# EAGLE design daughterboard (EAGLE 6.3)
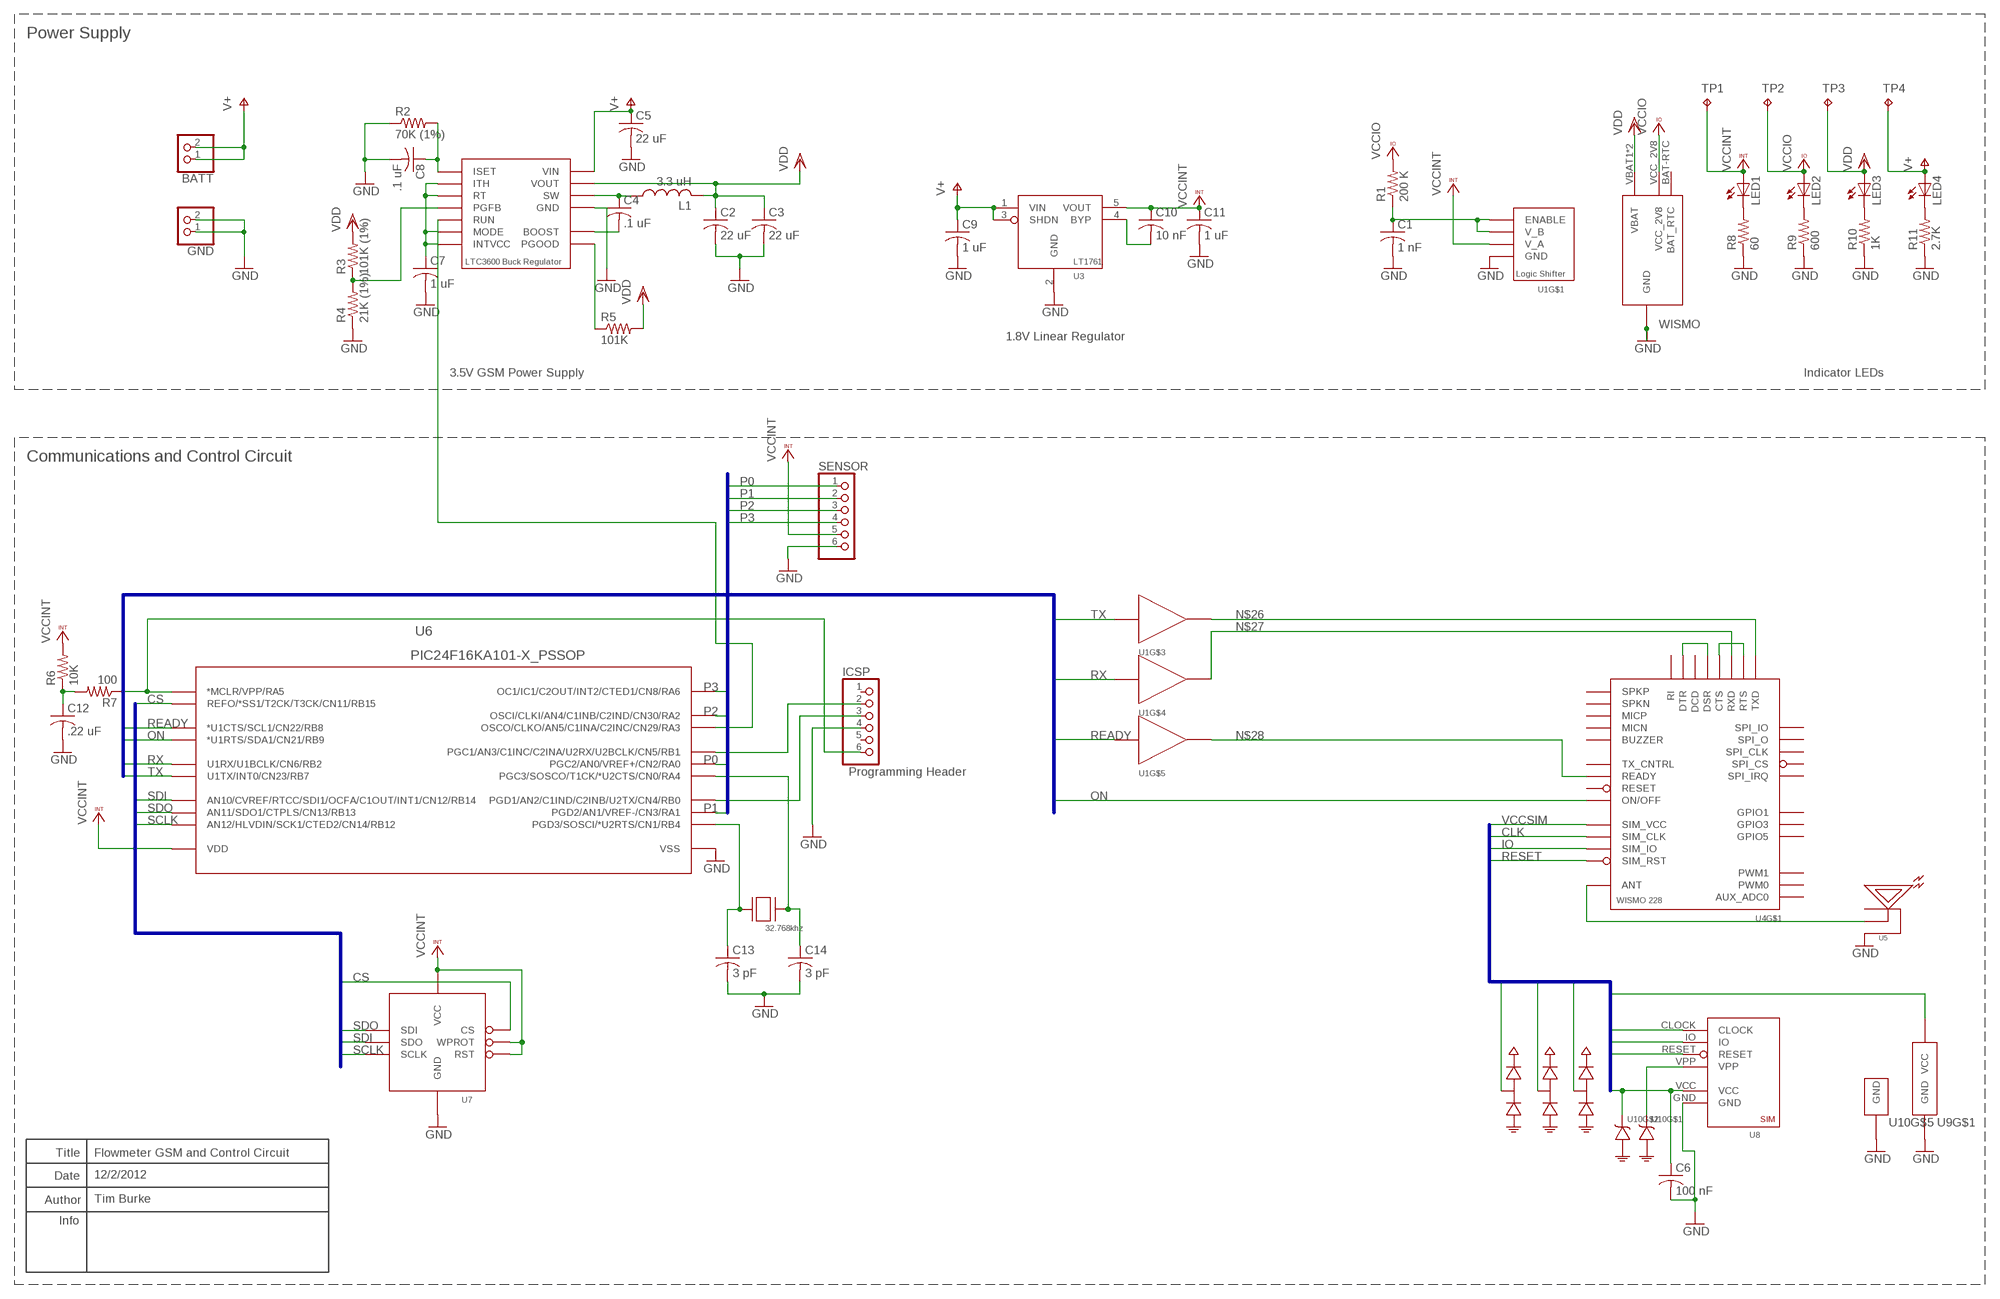
[diagram p0: schematic, sheet 1]

## Parts
BATT  PINHD-1X2  [1X02]
C1  1 nF  C-USC0402K  [C0402K]
C2  22 uF  C-USC1206  [C1206]
C3  22 uF  C-USC1206  [C1206]
C4  .1 uF  C-USC0402  [C0402]
C5  22 uF  C-USC1206K  [C1206K]
C6  100 nF  C-USC0402K  [C0402K]
C7  1 uF  C-USC0402K  [C0402K]
C8  .1 uF  C-USC0402K  [C0402K]
C9  1 uF  C-USC0402K  [C0402K]
C10  10 nF  C-USC0402K  [C0402K]
C11  1 uF  C-USC0402K  [C0402K]
C12  .22 uF  C-USC0402K  [C0402K]
C13  3 pF  C-USC0402K  [C0402K]
C14  3 pF  C-USC0402K  [C0402K]
GND  PINHD-1X2  [1X02]
ICSP  PINHD-1X6  [1X06]
L1  3.3 uH  L-US  [INDUCTORPROTO]
LED1  LEDSML0603  [SML0603]
LED2  LEDSML0603  [SML0603]
LED3  LEDSML0603  [SML0603]
LED4  LEDSML0603  [SML0603]
R1  200 K  R-US_R0603  [R0603]
R2  70K (1%)  R-US_R0603  [R0603]
R3  101K (1%)  R-US_R0603  [R0603]
R4  21K (1%)  R-US_R0603  [R0603]
R5  101K  R-US_R0603  [R0603]
R6  10K  R-US_R0603  [R0603]
R7  100  R-US_R0603  [R0603]
R8  60  R-US_R0603  [R0603]
R9  600  R-US_R0603  [R0603]
R10  1K  R-US_R0603  [R0603]
R11  2.7K  R-US_R0603  [R0603]
SENSOR  PINHD-1X6  [1X06]
TP1  TPB2,54  [B2,54]
TP2  TPB2,54  [B2,54]
TP3  TPB2,54  [B2,54]
TP4  TPB2,54  [B2,54]
U1  LEVELSHIFTER  [TSSOP16]
U2  LTC3600  [MSOP12]
U3  LT1761  [SOT23-5L]
U4  WISMO_228  [GSM_MODULE]
U5  RFANTENNA  [RFJACK]
U6  PIC24F16KA101-X_PSSOP  [SSOP20]
U7  FLASH8MSOP8  [SOP08]
U8  SIMSLOT  [SIMSLOT]
U9  DALC208  [SOT23-6L]
U10  ESDA6V1SC6  [SOT23-6L]
XTAL1  32.768khz  SMD-XTAL  [SMDXTAL]

## Nets
CLK: U4.SIM_CLK U8.CLOCK U9.1
CS: U6.18(REFO/*SS1/T2CK/T3CK/CN11/RB15) U7.1(CS)
GND: C1.2 C2.2 C3.2 C5.2 C6.2 C7.2 C8.2 C9.2 C11.2 C12.2 C13.2 C14.2 GND.1 GND.2 ICSP.4 R2.1 R4.1 R8.1 R9.1 R10.1 R11.1 SENSOR.6 U1.1(GND) U2.EXPOSED(GND) U3.2(GND) U4.GND U4.GND1(GND) U4.GND2(GND) U4.GND3(GND) U4.GND4(GND) U4.GND5(GND) U5.UNUSED1(SHIELD) U5.UNUSED2(SHIELD) U6.19(VSS) U7.4(GND) U8.GND U9.5(GND) U10.2 U10.5
IO: U4.SIM_IO U8.IO U9.4
N$1: U4.ANT U5.ANTENNA(PIN)
N$2: C7.1 U2.PAD2(ITH) U2.PAD3(RT) U2.PAD6(MODE) U2.PAD10(INTVCC)
N$3: U4.CT107/DSR(DSR) U4.CT108/DTR(DTR)
N$4: C1.1 R1.1 U1.15(V_B) U1.16(ENABLE)
N$5: U8.VPP U10.1
N$6: R3.1 R4.2 U2.PAD4(PGFB)
N$7: LED1.C R8.2
N$8: LED2.C R9.2
N$9: C4.2 U2.PAD9(BOOST)
N$10: C8.1 R2.2 U2.PAD1(ISET)
N$11: LED3.C R10.2
N$12: LED4.C R11.2
N$14: U2.PAD5(RUN) U6.8(OSCO/CLKO/AN5/C1INA/C2INC/CN29/RA3)
N$17: R5.1 U2.PAD12(PGOOD)
N$18: ICSP.2 U6.5(PGC1/AN3/C1INC/C2INA/U2RX/U2BCLK/CN5/RB1)
N$19: ICSP.3 U6.4(PGD1/AN2/C1IND/C2INB/U2TX/CN4/RB0)
N$20: C10.2 U3.4(BYP)
N$21: C12.1 R6.1 R7.2
N$22: ICSP.6 R7.1 U6.1(*MCLR/VPP/RA5)
N$23: U4.CT105/RTS(RTS) U4.CT106/CTS(CTS)
N$24: C14.1 U6.10(PGC3/SOSCO/T1CK/*U2CTS/CN0/RA4) XTAL1.4(XTAL2)
N$25: C13.1 U6.9(PGD3/SOSCI/*U2RTS/CN1/RB4) XTAL1.1(XTAL1)
N$26: U1.13(B) U4.CT103/TXD(TXD)
N$27: U1.12(B) U4.CT104/RXD(RXD)
N$28: U1.11(B) U4.WISMO_READY(READY)
ON: U4.ON/OFF U6.13(*U1RTS/SDA1/CN21/RB9)
P0: SENSOR.1 U6.2(PGC2/AN0/VREF+/CN2/RA0)
P1: SENSOR.2 U6.3(PGD2/AN1/VREF-/CN3/RA1)
P2: SENSOR.3 U6.7(OSCI/CLKI/AN4/C1INB/C2IND/CN30/RA2)
P3: SENSOR.4 U6.14(OC1/IC1/C2OUT/INT2/CTED1/CN8/RA6)
READY: U1.6(A) U6.12(*U1CTS/SCL1/CN22/RB8)
RESET: U4.SIM_RST U8.RESET U9.3
RX: U1.5(A) U6.6(U1RX/U1BCLK/CN6/RB2)
SCLK: U6.15(AN12/HLVDIN/SCK1/CTED2/CN14/RB12) U7.6(SCLK)
SDI: U6.17(AN10/CVREF/RTCC/SDI1/OCFA/C1OUT/INT1/CN12/RB14) U7.2(SDO)
SDO: U6.16(AN11/SDO1/CTPLS/CN13/RB13) U7.5(SDI)
SW: C4.1 L1.P1 U2.PAD7(SW)
TX: U1.4(A) U6.11(U1TX/INT0/CN23/RB7)
V+: BATT.1 BATT.2 C5.1 C9.1 LED4.A TP4.TP U2.PAD8(VIN) U3.1(VIN) U3.3(SHDN)
VCCINT: C10.1 C11.1 LED1.A R6.2 SENSOR.5 TP1.TP U1.2(V_A) U3.5(VOUT) U6.20(VDD) U7.3(WPROT) U7.7(RST) U7.8(VCC)
VCCIO: LED2.A R1.2 TP2.TP U4.VCC_2V8
VCCSIM: C6.1 U4.SIM_VCC U8.VCC U9.2(VCC) U10.3
VDD: C2.1 C3.1 L1.P2 LED3.A R3.2 R5.2 TP3.TP U2.PAD11(VOUT) U4.VBAT1(VBAT) U4.VBAT2(VBAT)
Unconnected: ICSP.1 ICSP.5 U1.3(A) U1.7(A) U1.8(A) U1.9(B) U1.10(B) U1.14(B) U4.AUX_ADC0 U4.BAT-RTC(BAT_RTC) U4.BUZZER U4.CT109/DCD(DCD) U4.CT125/RI(RI) U4.GPIO1 U4.GPIO3 U4.GPIO5 U4.MICN U4.MICP U4.PWM0 U4.PWM1 U4.RESET U4.SPI-CLK(SPI_CLK) U4.SPI-CS(SPI_CS) U4.SPI-IO(SPI_IO) U4.SPI-IRQ(SPI_IRQ) U4.SPI-O(SPI_O) U4.SPKN U4.SPKP U4.TX_CTRL(TX_CNTRL) U9.6 U10.4 U10.6

## Buses
VCCSIM,CLK,IO,RESET
SPI:CS,SDI,SDO,SCLK
COMMS:TX,RX,READY,ON
EXTERNAL:P[0..5]

## Notes on the sheet
- Power Supply
- WISMO
- 1.8V Linear Regulator
- 3.5V GSM Power Supply | Indicator LEDs
- Communications and Control Circuit
- Programming Header
- Title | Flowmeter GSM and Control Circuit
- Date | 12/2/2012
- Author | Tim Burke
- Info

## Library data of the parts
BATT GND = pinhead:PINHD-1X2: PIN HEADER
C1-C14 = rcl:C-US: CAPACITOR, American symbol
ICSP SENSOR = pinhead:PINHD-1X6: PIN HEADER
L1 = components:L-US: INDUCTOR, American symbol
LED1-LED4 = led:LED: LED OSRAM: - CHIPLED LG R971, LG N971, LY N971, LG Q971, LY Q971, LO R971, LY R971 LH N974, LH R974 LS Q976, LO Q976, LY Q976 LO Q996 - Hyper CHIPLED LW Q18S LB Q993, LB Q99A, LB R99A - SideLED LS A670, LO A670, LY A670, LG A670, LP A670 LB A673, LV A673, LT A673, LW A673 LH A674 LY A675 LS A676, LA A676, LO A676, LY A676, LW A676 LS A679, LY A679, LG A679 - Hyper Micro SIDELED® LS Y876, LA Y876, LO Y876, LY Y876 LT Y87S - SmartLED LW L88C, LW L88S LB L89C, LB L89S, LG L890 LS L89K, LO L89K, LY L89K LS L896, LA L896, LO L896, LY L896 - TOPLED LS T670, LO T670, LY T670, LG T670, LP T670 LSG T670, LSP T670, LSY T670, LOP T670, LYG T670 LG T671, LOG T671, LSG T671 LB T673, LV T673, LT T673, LW T673 LH T674 LS T676, LA T676, LO T676, LY T676, LB T676, LH T676, LSB T676, LW T676 LB T67C, LV T67C, LT T67C, LS T67K, LO T67K, LY T67K, LW E67C LS E67B, LA E67B, LO E67B, LY E67B, LB E67C, LV E67C, LT E67C LW T67C LS T679, LY T679, LG T679 LS T770, LO T770, LY T770, LG T770, LP T770 LB T773, LV T773, LT T773, LW T773 LH T774 LS E675, LA E675, LY E675, LS T675 LS T776, LA T776, LO T776, LY T776, LB T776 LHGB T686 LT T68C, LB T68C - Hyper Mini TOPLED® LB M676 - Mini TOPLED Santana® LG M470 LS M47K, LO M47K, LY M47K Source: http://www.osram.convergy.de LUXEON: - LUMILED® LXK2-PW12-R00, LXK2-PW12-S00, LXK2-PW14-U00, LXK2-PW14-V00 LXK2-PM12-R00, LXK2-PM12-S00, LXK2-PM14-U00 LXK2-PE12-Q00, LXK2-PE12-R00, LXK2-PE12-S00, LXK2-PE14-T00, LXK2-PE14-U00 LXK2-PB12-K00, LXK2-PB12-L00, LXK2-PB12-M00, LXK2-PB14-N00, LXK2-PB14-P00, LXK2-PB14-Q00 LXK2-PR12-L00, LXK2-PR12-M00, LXK2-PR14-Q00, LXK2-PR14-R00 LXK2-PD12-Q00, LXK2-PD12-R00, LXK2-PD12-S00 LXK2-PH12-R00, LXK2-PH12-S00 LXK2-PL12-P00, LXK2-PL12-Q00, LXK2-PL12-R00 Source: www.luxeon.com KINGBRIGHT: KA-3528ASYC Source: www.kingbright.com
R1-R11 = rcl:R-US_: RESISTOR, American symbol
TP1-TP4 = testpad:TP: Test pad
U1 = components:LEVELSHIFTER
U2 = components:LTC3600: LTC3600 Buck Regulator
U3 = components:LT1761: LT1761 - 1.8V Low Quiescent Current Linear Regulator
U4 = components:WISMO_228: WISMO 228 GSM Integrated Module from AirPrime
U5 = components:RFANTENNA
U6 = components:PIC24F16KA101-X_P
U7 = components:FLASH8M
U8 = components:SIMSLOT: Molex SIM Card Slot
U9 = components:DALC208: Low Capacitance Diode Array (4 Pack)
U10 = components:ESDA6V1SC6: ESD Diode Array (4-pack)
XTAL1 = components:SMD-XTAL

## Net classes
0 default: width 0.203 mm, drill 0.381 mm, clearance 0.203 mm

## Board
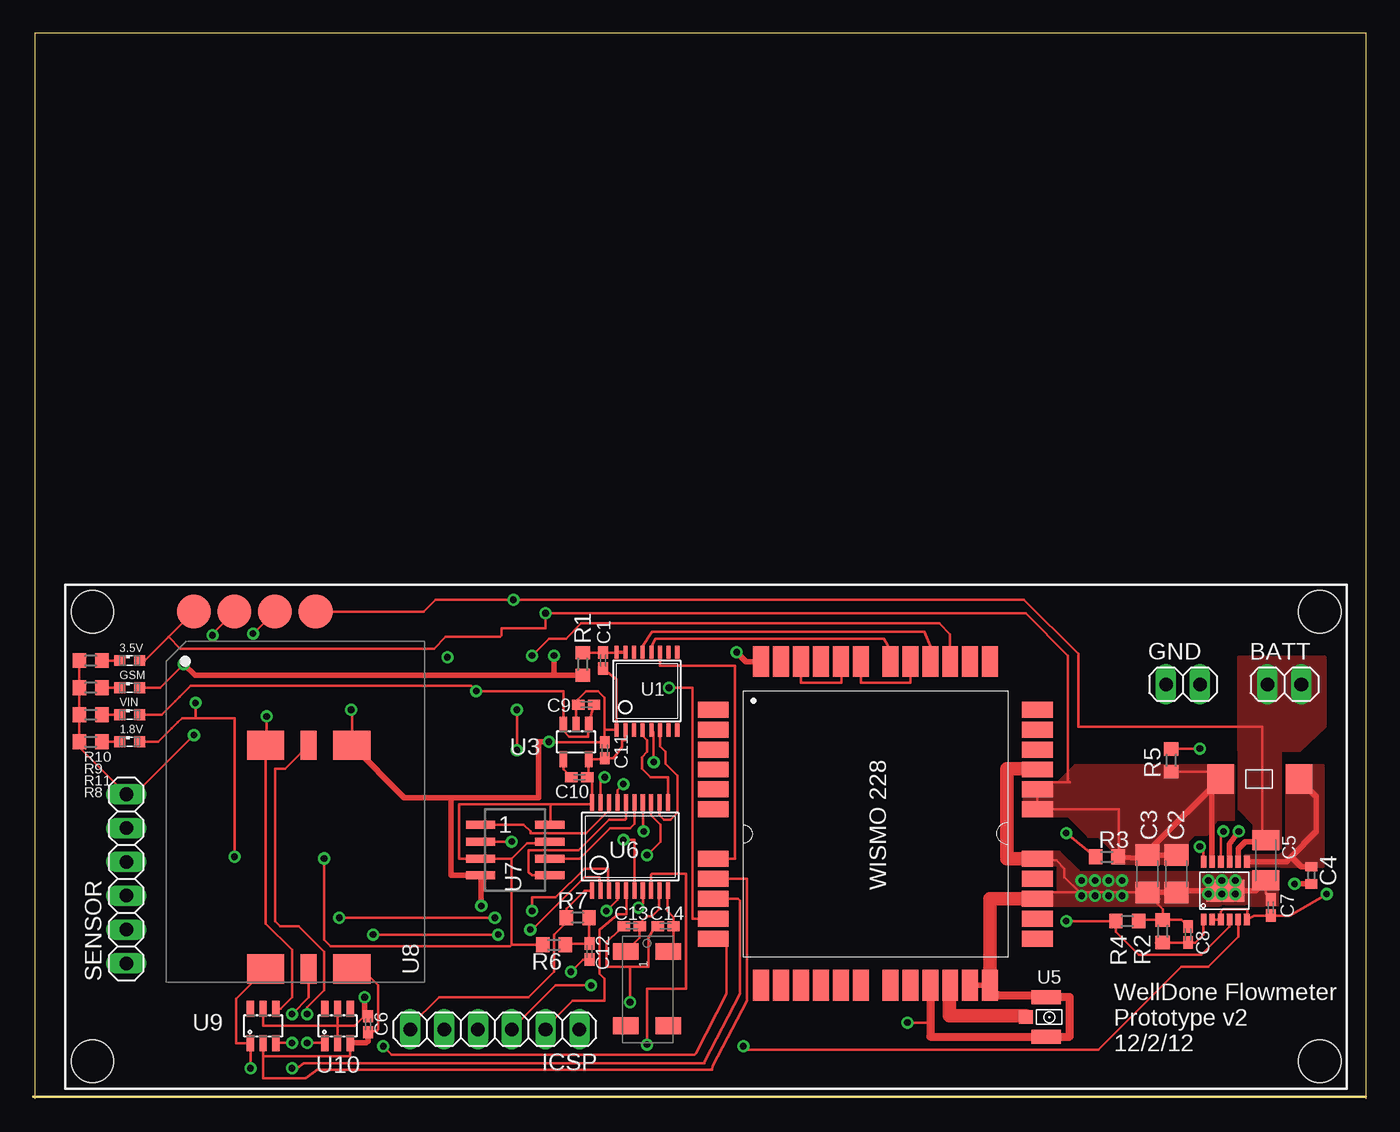
[diagram p1: board, top side]
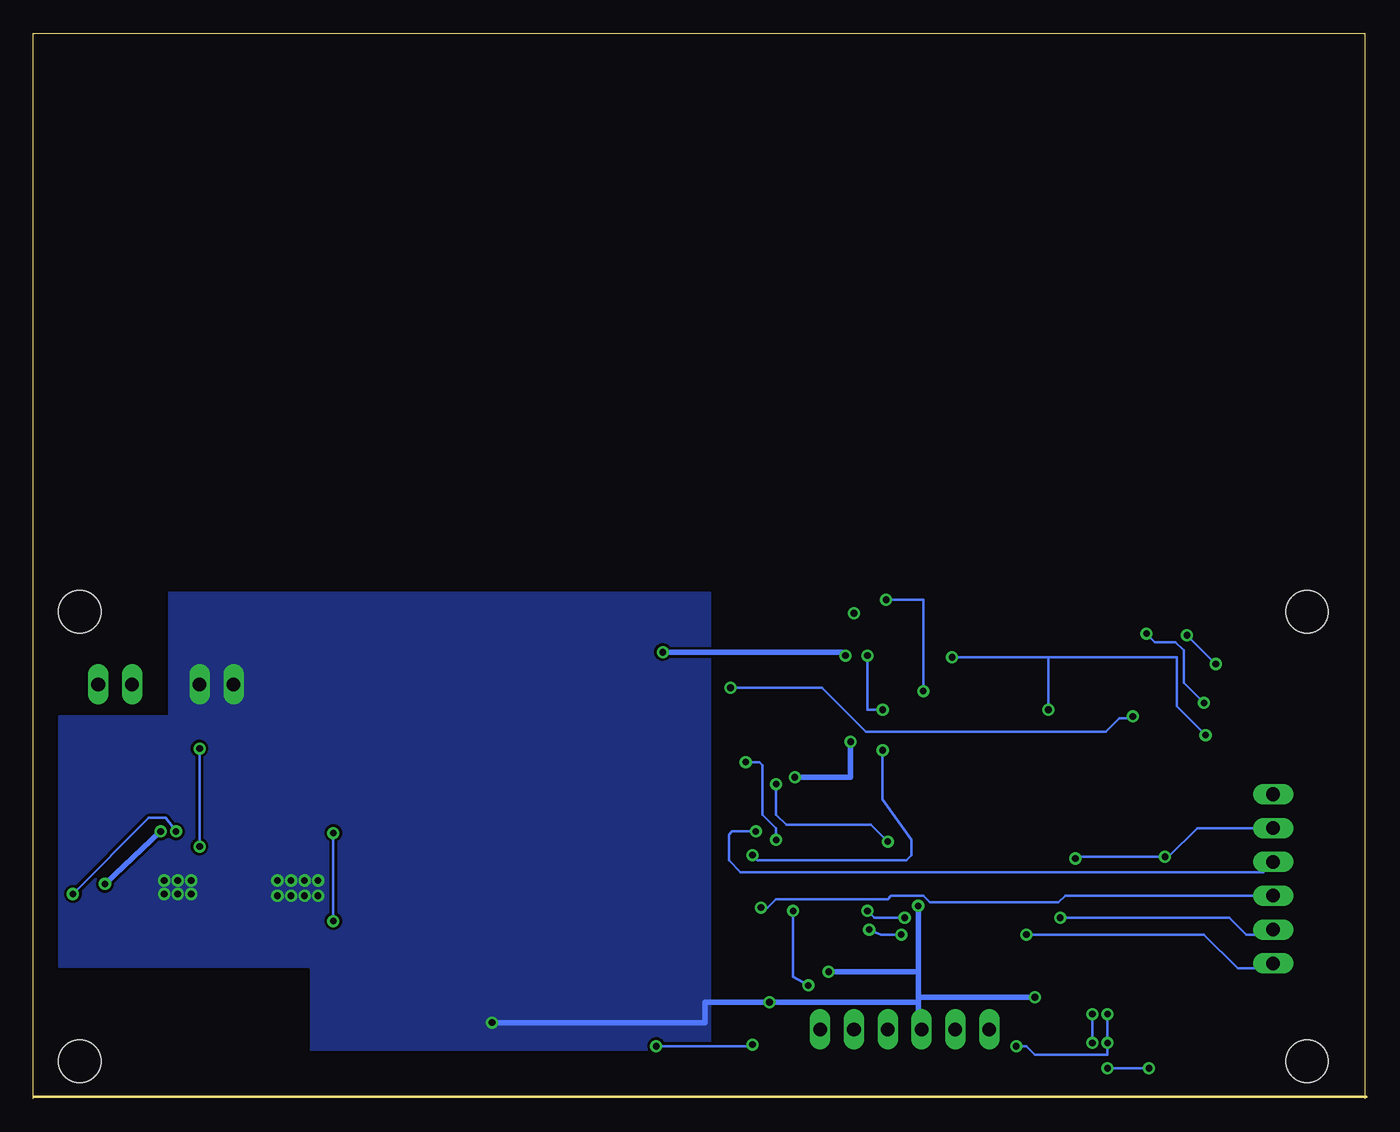
[diagram p2: board, bottom side, seen from below]

Size 100.13 x 80 mm. Coordinates in mm from the lower left corner, seen from the top.
Outline: 100.13,0 100.13,80 0.13,80 0.13,0
Outline: 100.08,0.13 0,0.13
Copper layers (1*16): Top 0.035mm / dielectric 1.5mm / Bottom 0.035mm
Design rules "default *": minimum track width 8mil, minimum drill 15mil, track to track 6mil, track to pad 6mil, pad to pad 6mil, via to via 6mil, smd to smd 6mil, copper to edge 40mil, drill to drill 8mil, minimum pad ring 10mil, minimum via ring 8mil, stop-mask expansion 4mil, vias tented up to drill 0mil, thermal gap 10mil
Holes 3.2 mm at 4.44,36.58 4.44,2.79 96.65,36.58 96.65,2.79

### Footprints (pad centres in the part's own frame; a part is rotated, then mirrored left to right if it is on the bottom)
1X02 = drill 1.016 long: 1 -1.27,0; 2 1.27,0
C0402K = smd 0.925 x 0.74: 1 -0.6,0; 2 0.6,0
C1206 = smd 1.6 x 1.8: 1 -1.4,0; 2 1.4,0
C0402 = smd 0.7 x 0.9: 1 -0.65,0; 2 0.65,0
C1206K = smd 1.5 x 2: 1 -1.5,0; 2 1.5,0
1X06 = drill 1.016 long: 1 -6.35,0; 2 -3.81,0; 3 -1.27,0; 4 1.27,0; 5 3.81,0; 6 6.35,0
INDUCTORPROTO = smd 2 x 2.2: P1 -3,0; P2 2.9,0
SML0603 = smd 0.8 x 0.8: A 0.75,0; C -0.75,0
R0603 = smd 1 x 1.1: 1 -0.85,0; 2 0.85,0
B2,54 = smd 2.54 x 2.54: TP 0,0
TSSOP16 = smd 0.305 x 0.991: 1 -2.275,-2.918; 2 -1.625,-2.918; 3 -0.975,-2.918; 4 -0.325,-2.918; 5 0.325,-2.918; 6 0.975,-2.918; 7 1.625,-2.918; 8 2.275,-2.918; 9 2.275,2.918; 10 1.625,2.918; 11 0.975,2.918; 12 0.325,2.918; 13 -0.325,2.918; 14 -0.975,2.918; 15 -1.625,2.918; 16 -2.275,2.918
MSOP12 = smd 2.845 x 1.651: EXPOSED 0,0 | smd 0.419 x 0.889: PAD1 -1.632,-2.172; PAD2 -0.982,-2.172; PAD3 -0.331,-2.172; PAD4 0.319,-2.172; PAD5 0.969,-2.172; PAD6 1.619,-2.172; PAD7 1.619,2.172; PAD8 0.969,2.172; PAD9 0.319,2.172; PAD10 -0.331,2.172; PAD11 -0.982,2.172; PAD12 -1.632,2.172
SOT23-5L = smd 0.55 x 1.2: 1 -0.95,-1.3; 2 0,-1.3; 3 0.95,-1.3; 4 0.95,1.3; 5 -0.95,1.3
GSM_MODULE = smd 2.3 x 1.2: ANT 21.2,-7.2; CT103/TXD -3.1,-8.7; CT104/RXD -3.1,-11.7; CT105/RTS -3.1,-10.2; CT106/CTS -3.1,-13.9; CT107/DSR -3.1,-15.4; CT108/DTR -3.1,-18.4; CT109/DCD -3.1,-16.9; CT125/RI -3.1,-19.9; GND1 21.2,-8.7; GND2 21.2,-5.7; GND3 21.2,-4.2; GPIO3 21.2,-15.4; GPIO5 21.2,-10.2; ON/OFF -3.1,-7.2; PWM0 -3.1,-5.7; PWM1 -3.1,-4.2; RESET 21.2,-21.4; SPI-CLK 21.2,-16.9; SPI-CS 21.2,-13.9; SPI-IO 21.2,-19.9; SPI-O 21.2,-18.4; TX_CTRL 21.2,-11.7; VCC_2V8 -3.1,-21.4 | smd 1.2 x 2.3: AUX_ADC0 6.5,-25; BAT-RTC 8,-25; BUZZER 0.5,-0.65; GND 11.7,-0.65; GND4 14.7,-0.65; GND5 5,-0.65; GPIO1 17.7,-0.65; MICN 5,-25; MICP 3.5,-25; NC 13.2,-0.65; NC2 3.5,-0.65; NC3 2,-0.65; SIM_CLK 14.7,-25; SIM_IO 16.2,-25; SIM_RST 17.7,-25; SIM_VCC 13.2,-25; SPI-IRQ 16.2,-0.65; SPKN 2,-25; SPKP 0.5,-25; VBAT1 8,-0.65; VBAT2 6.5,-0.65; WISMO_READY 11.7,-25
RFJACK = smd 1.05 x 1: ANTENNA 2.795,1.488 | smd 2.2 x 1.05: UNUSED1 1.27,2.953; UNUSED2 1.27,0
SSOP20 = smd 0.305 x 1.245: 1 -2.857,-3.302; 2 -2.222,-3.302; 3 -1.587,-3.302; 4 -0.952,-3.302; 5 -0.317,-3.302; 6 0.318,-3.302; 7 0.953,-3.302; 8 1.588,-3.302; 9 2.223,-3.302; 10 2.858,-3.302; 11 2.858,3.302; 12 2.223,3.302; 13 1.588,3.302; 14 0.953,3.302; 15 0.318,3.302; 16 -0.317,3.302; 17 -0.952,3.302; 18 -1.587,3.302; 19 -2.222,3.302; 20 -2.857,3.302
SOP08 = smd 0.6 x 2.2: 1 -1.905,-2.6; 2 -0.635,-2.6; 3 0.635,-2.6; 4 1.905,-2.6; 5 1.905,2.6; 6 0.635,2.6; 7 -0.635,2.6; 8 -1.905,2.6
SIMSLOT = smd 2.2 x 2.8: CLOCK 1.1,3.24; GND 17.9,-3.24; IO 17.9,3.24; VCC 1.1,-3.24 | smd 2.2 x 1.2: RESET 1.1,0; VPP 17.9,0
SOT23-6L = smd 0.55 x 1.2: 1 -0.95,-1.3; 2 0,-1.3; 3 0.95,-1.3; 4 0.95,1.3; 5 0,1.3; 6 -0.95,1.3
SMDXTAL = smd 1.27 x 1.905: 1 -2.794,-1.587; 2 2.794,-1.587; 3 2.794,1.587; 4 -2.794,1.587

### Placement (x,y rotation side)
BATT  93.98,31.11 0 top
C1  42.8,32.89 270 top
C2  85.85,16.89 270 top
C3  83.69,16.89 270 top
C4  96.01,16.76 270 top
C5  92.58,17.91 270 top
C6  25.15,5.59 90 top
C7  92.96,14.35 90 top
C8  86.74,12.32 90 top
C9  41.53,29.59 180 top
C10  41.02,24.13 180 top
C11  42.93,26.16 90 top
C12  41.78,11.05 270 top
C13  44.96,12.95 180 top
C14  47.5,12.95 180 top
GND  86.36,31.11 0 top
ICSP  34.67,5.21 180 top
L1  92.07,24 180 top
LED1  7.24,26.8 0 top
LED2  7.24,30.86 0 top
LED3  7.24,32.89 0 top
LED4  7.24,28.83 0 top
R1  41.28,32.64 270 top
R2  84.84,12.57 270 top
R3  80.64,18.16 0 top
R4  82.17,13.34 180 top
R5  85.47,25.4 270 top
R6  39.12,11.56 180 top
R7  40.89,13.59 0 top
R8  4.32,26.8 0 top
R9  4.32,30.86 0 top
R10  4.32,32.89 0 top
R11  4.32,28.83 0 top
SENSOR  6.98,16.51 90 top
TP1  18.16,36.58 0 top
TP2  15.11,36.58 0 top
TP3  12.07,36.58 0 top
TP4  21.21,36.58 0 top
U1  46.1,30.61 0 top
U2  89.53,15.62 0 top
U3  40.77,26.8 180 top
U4  76.07,29.72 270 top
U5  77.34,7.62 180 top
U6  44.83,18.92 0 top
U7  36.2,18.67 270 top
U8  20.7,8.64 90 top
U9  17.27,5.46 0 top
U10  22.86,5.46 0 top
XTAL1  46.1,8.26 270 top

### Tracks (layer width: path | path; a pad name or v marks a point on that pad's centre or on a via)
CLK  (via drill 0.5)
  Top 0.203: U8.CLOCK 15.24,7.51 15.24,4.16 U9.1 v16.32,2.29 | U4.SIM_CLK 52.93,15.02 53.09,14.86 53.09,7.87 50.43,2.79 50.42,2.67 20.32,2.67 19.81,2.29 v19.43,2.29
  Bottom 0.203: v16.32,2.29 v19.43,2.29
CS
  Top 0.203: U7.1 36.83,20.57 37.34,20.07 37.34,19.94 41.53,19.94 43.24,21.65 U6.18 43.24,21.91
GND  (via drill 0.5)
  Top 0.203: R4.1 83.11,13.42 R2.1 | R2.1 86.24,13.42 C8.2 | 84.58,14.98 C3.2 | C7.2 92.58,15.46 C5.2 | R2.1 84.84,14.22 83.69,15.37 C3.2 | C1.2 43.82,31.5 43.82,27.7 U1.1 42.93,27.69 | U3.2 40.77,29.59 C9.2 40.93,30.01 41.53,30.61 42.42,30.61 42.93,30.1 42.93,27.69 | 42.93,27.69 C11.2 38.73,26.76 v38.73,26.8 | U4.GND4 75.9,15.49 C3.2 | U4.GND 75.53,17.91 76.83,17.91 77.47,17.27 77.47,16.64 78.62,15.49 C3.2 | C14.2 46.48,12.54 46.23,12.06 46.23,9.91 44.83,9.91 | C13.2 43.05,11.78 43.05,9.91 44.83,9.91 | U7.4 33.66,16.76 | C12.2 41.31,10.45 v40.39,9.53 | 44.83,9.91 v44.83,7.24 | 22.86,5.46 U10.2 | U10.5 22.86,5.46 | 22.86,5.46 24.13,5.46 24.86,6.19 C6.2 24.89,6.19 | U9.5 17.27,5.46 22.86,5.46 | U8.GND 23.94,29.14 v23.88,29.21 | v31.11,33.15 31.11,33.16 | U6.19 42.61,24.13 v42.93,24.13 | U4.GND1 67.44,8.52 67.44,5.71 v65.66,5.71 | R8.1 R11.1 R9.1 R10.1 | 3.43,26.76 R8.1 | v12.07,27.3 7.62,22.86 SENSOR.6 3.47,26.38 R8.1
  Top 0.406: U4.GND3 U4.GND2 | C3.2 C2.2 86.36,15.62 U2.EXPOSED 91.8,15.62 C5.2 | 33.66,16.76 v33.66,14.48 | 24.89,6.19 v24.89,7.62 | U7.4 31.37,16.76 31.37,22.61 | 31.37,22.61 37.97,22.61 37.97,26.8 v38.73,26.8 | 31.37,22.61 27.87,22.61 U8.GND
  Top 0.61: U4.GND1 67.37,4.67 U5.UNUSED1 77.85,4.67 77.85,7.62 U5.UNUSED2 76.07,7.75 72.64,7.75 arc-90 U4.GND3
  Top 1.016: U4.GND 73.15,18.02 73.15,24.77 75.42,24.77 U4.GND5 | U4.GND4 71.87,15.02 U4.GND3
  Bottom 0.203: 33.66,5.46 ICSP.4 | 33.78,9.53 33.66,9.4 | v23.88,29.21 23.88,33.15 | 23.88,33.15 v31.11,33.15 | 23.88,33.15 14.22,33.15 14.22,29.46 v12.07,27.3
  Bottom 0.406: v33.66,14.48 33.66,9.4 33.66,7.62 | 33.66,7.62 33.66,7.24 | 33.66,7.24 33.66,5.46 | v40.39,9.53 33.78,9.53 | 33.66,7.24 v44.83,7.24 49.66,7.24 49.66,5.71 v65.66,5.71 | v24.89,7.62 33.66,7.62 | v42.93,24.13 38.73,24.13 v38.73,26.8
  other vias: 78.74,16.38 79.76,16.38 80.77,16.38 81.79,16.38 81.79,15.24 80.77,15.24 79.76,15.24 78.74,15.24 88.27,16.38 89.28,16.38 90.3,16.38 90.3,15.37 89.28,15.37 88.27,15.37
  pour Top (no thermals): 74.3,14.48 93.47,14.48 93.47,17.02 78.49,17.02 78.49,17.14 77.09,18.54 74.3,18.54 74.3,17.53 76.96,17.53 76.96,15.49 74.3,15.49
  pour Bottom (no thermals): 49.28,3.68 49.28,37.97 89.92,37.97 89.92,28.7 98.17,28.7 98.17,9.91 79.25,9.91 79.25,3.68
IO  (via drill 0.5)
  Top 0.203: U9.4 18.57,6.76 19.43,7.62 19.43,11.18 17.46,13.15 U8.IO 17.53,26.6 v17.53,28.7 | U4.SIM_IO 49.53,13.52 49.53,30.86 v47.75,30.86
  Bottom 0.203: v17.53,28.7 17.65,28.57 18.54,28.57 19.56,27.56 37.59,27.56 40.89,30.86 v47.75,30.86
N$1
  Top 1.016: U4.ANT 68.83,8.52 68.83,6.22 74.55,6.22 U5.ANTENNA
N$2  (via drill 0.5)
  Top 0.203: U2.PAD2 U2.PAD3 89.2,14.02 89.41,14.22 91.19,14.22 91.19,13.48 | 91.19,13.48 U2.PAD6 | U2.PAD10 89.2,19.73 v89.41,20.07 | v97.16,15.37 94.4,13.75 C7.1 91.71,13.75 91.19,13.48
  Bottom 0.203: v89.41,20.07 90.17,21.08 91.44,21.08 v97.16,15.37
N$3
  Top 0.203: U4.CT108/DTR 57.67,31.24 60.71,31.24 60.71,32.82 U4.CT107/DSR
N$4
  Top 0.203: U1.16 43.79,33.49 C1.1 R1.1
  Top 0.254: U1.15 U1.16
N$5  (via drill 0.5)
  Top 0.203: U10.1 21.91,4.19 v20.57,4.19 | v20.57,6.35 20.57,6.86 21.84,8.13 21.84,11.05 19.94,12.95 18.54,12.95 18.16,13.34 18.16,24.77 18.93,24.77 U8.VPP
  Bottom 0.203: v20.57,4.19 v20.57,6.35
N$6  (via drill 0.5)
  Top 0.203: U2.PAD4 89.85,12.89 87.76,10.79 83.06,10.79 81.32,12.53 R4.2 v77.6,13.34 | R3.1 v77.6,19.94
  Bottom 0.203: v77.6,19.94 v77.6,13.34
N$7
  Top 0.203: R8.2 LED1.C
N$8
  Top 0.203: R9.2 LED2.C
N$9  (via drill 0.5)
  Top 0.406: U2.PAD9 89.85,19.11 v90.55,20.07 | v94.74,16.13 96,16.13 C4.2
  Bottom 0.406: v90.55,20.07 v94.74,16.13
N$10
  Top 0.203: R2.2 84.33,11.72 C8.1 87.28,11.72 87.88,12.32 87.88,13.43 U2.PAD1
N$11
  Top 0.203: R10.2 LED3.C
N$12
  Top 0.203: R11.2 LED4.C
N$14  (via drill 0.5)
  Top 0.203: v46.1,4.06 46.1,8.26 49.02,8.26 49.02,16.89 46.48,16.89 46.42,16.83 U6.8 | U2.PAD5 90.5,12.14 88.27,9.91 86.23,9.91 80.01,3.68 53.59,3.68 v53.34,3.94
  Bottom 0.203: v46.1,4.06 46.1,3.94 v53.34,3.94
N$17  (via drill 0.5)
  Top 0.203: U2.PAD12 87.9,18.52 v87.63,18.92 | v87.63,26.29 85.51,26.29 R5.1
  Bottom 0.203: v87.63,18.92 v87.63,26.29
N$18
  Top 0.203: ICSP.2 38.48,5.33 40.51,7.37 42.93,7.37 42.93,9.02 42.55,9.4 42.55,12.7 43.94,13.84 44.58,13.84 44.58,15.56 U6.5
N$19  (via drill 0.5)
  Top 0.203: U6.4 43.88,14.92 v43.05,14.1 | v41.91,8.51 39.24,8.51 ICSP.3
  Bottom 0.203: v43.05,14.1 43.05,9.14 v41.91,8.51
N$20
  Top 0.203: C10.2 39.82,24.73 U3.4
N$21
  Top 0.203: R7.2 41.74,11.69 C12.1 40.06,11.65 R6.1
N$22
  Top 0.203: U6.1 41.4,15.62 40.04,14.26 R7.1 40.04,13.25 39.12,12.32 39.12,9.53 37.21,7.62 30.48,7.62 28.32,5.46 ICSP.6
N$23
  Top 0.203: U4.CT106/CTS 62.17,31.24 65.87,31.24 U4.CT105/RTS
N$24
  Top 0.203: XTAL1.4 arc90 48.1,11.46 C14.1 48.1,13.62 47.62,14.1 47.62,15.56 U6.10
N$25
  Top 0.203: XTAL1.1 45.56,12.09 C13.1 45.56,13.17 46.1,13.72 46.48,13.72 46.99,14.22 46.99,15.56 U6.9
N$26
  Top 0.203: U1.13 45.78,33.97 46.48,35.05 66.93,35.05 67.37,33.97 U4.CT103/TXD
N$27
  Top 0.203: U1.12 46.43,33.98 46.74,34.54 63.88,34.54 64.37,33.67 U4.CT104/RXD
N$28
  Top 0.203: U1.11 47.08,32.51 52.71,32.51 52.71,18.02 U4.WISMO_READY
ON  (via drill 0.5)
  Top 0.203: U4.ON/OFF 68.87,34.89 68.07,35.69 41.15,35.69 40.01,34.54 38.73,34.54 v37.47,33.27 | 46.48,22.16 U6.13 46.42,21.27 47.12,20.57 47.12,19.3 v46.1,18.29 | v36.32,29.21 v36.32,26.16
  Bottom 0.203: v37.47,33.27 37.47,29.21 v36.32,29.21 | v36.32,26.16 36.32,22.48 34.16,19.43 34.16,18.29 34.54,17.91 45.72,17.91 v46.1,18.29
P0  (via drill 0.5)
  Top 0.203: U6.2 42.55,15.69 42.55,16.64 41.4,16.64 37.47,12.7 v37.34,12.7 | v34.93,12.32 v25.53,12.32
  Bottom 0.203: v37.34,12.7 36.45,12.32 v34.93,12.32 | v25.53,12.32 12.19,12.32 9.65,9.78 7.37,9.78 SENSOR.1
P1  (via drill 0.5)
  Top 0.203: U6.3 43.18,15.69 43.18,17.27 41.4,17.27 39.24,15.11 37.47,15.11 v37.47,14.1 | v34.67,13.59 v22.99,13.59
  Bottom 0.203: v37.47,14.1 36.96,13.59 v34.67,13.59 | v22.99,13.59 10.29,13.59 9.02,12.32 7.37,12.32 SENSOR.2
P2  (via drill 0.5)
  Top 0.203: U6.7 45.78,14.67 v45.47,14.35
  Bottom 0.203: v45.47,14.35 44.96,14.35 44.32,14.99 35.94,14.99 35.69,15.24 33.27,15.24 32.77,14.73 23.11,14.73 22.61,15.24 SENSOR.3
P3  (via drill 0.5)
  Top 0.203: U6.14 45.78,20.13 v45.85,20.07
  Bottom 0.203: v45.85,20.07 47.62,20.07 47.88,19.81 47.88,17.91 46.99,17.02 7.75,17.02 SENSOR.4
READY
  Top 0.203: 47.12,27.69 U1.6 47.08,26.46 47.5,26.04 47.5,25.15 48.39,24.26 48.39,21.46 47.88,20.95 47.37,20.95 47.05,21.27 U6.12
RESET  (via drill 0.5)
  Top 0.203: U9.3 18.25,4.19 v19.43,4.19 | 20.57,9.74 U8.RESET 20.7,7.62 v19.43,6.35 | U4.SIM_RST 52.07,12.02 52.07,7.87 49.78,3.43 49.66,3.3 26.92,3.3 v26.29,3.94
  Bottom 0.203: v19.43,6.35 v19.43,4.19 19.43,3.43 | 19.43,3.3 19.43,3.43 | v26.29,3.94 25.53,3.94 24.89,3.3 19.56,3.3 arc-90 19.43,3.43
RX  (via drill 0.5)
  Top 0.203: U6.6 45.15,19.43 v44.32,19.43 | v46.61,25.27 46.61,27.51 U1.5
  Bottom 0.203: v46.61,25.27 45.59,25.27 45.34,25.02 45.34,21.34 44.32,20.32 v44.32,19.43
SCLK
  Top 0.203: U6.15 45.15,20.64 44.83,20.32 43.31,20.32 41.02,18.03 U7.6
SDI  (via drill 0.5)
  Top 0.203: U6.17 43.88,23.18 v44.32,23.62 | v35.94,19.3 U7.2
  Bottom 0.203: v44.32,23.62 44.32,21.34 43.56,20.57 37.21,20.57 v35.94,19.3
SDO
  Top 0.203: U7.5 37.47,16.76 37.21,17.02 37.21,18.67 40.96,18.67 43.24,20.95 44.45,20.95 44.51,21.02 U6.16
SW
  Top 0.406: U2.PAD7 94.12,17.79 94.49,18.16 | 94.49,18.16 96.39,20.07 96.39,22.68 L1.P1 | C4.1 95.23,17.41 94.49,18.16
  pour Top (no thermals): 91.06,18.29 93.6,18.29 94.11,18.67 94.11,25.02 96.9,25.02 96.9,17.4 91.06,17.4
TX
  Top 0.203: U1.4 45.78,27.25 46.1,26.92 46.1,26.04 45.72,25.65 45.72,24.77 46.36,24.13 47.69,24.13 U6.11
V+  (via drill 0.5)
  Top 0.203: C9.1 U3.1 41.72,27.75 41.66,27.18 40.26,27.18 39.82,27.62 U3.3 39.82,30.61 v33.27,30.61 32.89,30.99 11.81,30.99 10.99,30.16 10.67,29.84 9.65,28.83 LED4.A | 90.5,18.75 90.55,18.75 90.55,18.8 90.68,18.8 91.06,19.18 92.2,19.18 92.33,19.3 92.33,27.94 78.49,27.94 78.49,33.4 74.42,37.47 v36.07,37.47 30.23,37.47 29.34,36.58 TP4.TP
  Top 0.406: U2.PAD8 90.5,18.75 90.55,18.8 91.06,19.3 92.33,19.3 92.48,19.3 C5.1
  Bottom 0.203: v36.07,37.47 33.27,37.47 v33.27,30.61
  pour Top (no thermals): 91.69,18.8 91.69,20.57 90.55,21.72 90.55,26.16 93.73,26.16 93.73,18.8
  pour Top (no thermals): 90.55,26.16 95.12,26.16 97.03,27.94 97.03,33.15 90.55,33.15
VCCINT  (via drill 0.5)
  Top 0.203: 35.94,18.03 U7.3 32,18.03 32,22.1 38.86,22.1 | 35.94,18.03 37.08,19.18 38.67,19.18 U7.7 | R6.2 35.94,11.56 | 35.94,11.56 35.94,18.03 | U7.8 38.86,20.64 38.86,22.1 | 38.86,22.1 41.85,22.1 U6.20 41.97,23.78 C10.1 41.72,24.23 U3.5 42.86,25.5 C11.1 43.6,25.56 44.22,26.44 44.22,26.92 44.45,26.92 44.45,27.69 U1.2 | 12.19,28.57 15.11,28.57 v15.11,18.16 | v21.84,18.03 21.84,11.94 22.35,11.43 35.81,11.43 35.94,11.56 | TP1.TP v16.51,34.92 | v12.19,29.72 12.19,28.57 | 12.19,28.57 11.18,28.57 10.86,28.26 10.41,27.81 9.4,26.8 LED1.A
  Bottom 0.203: v21.84,18.03 21.84,18.16 v15.11,18.16 14.86,18.16 12.7,20.32 SENSOR.5 | v16.51,34.92 15.88,34.29 14.35,34.29 13.72,33.66 13.72,31.24 v12.19,29.72
VCCIO  (via drill 0.5)
  Top 0.203: v13.46,34.8 13.46,34.92 TP2.TP | LED2.A 9.53,30.86 v11.3,32.64
  Top 0.406: R1.2 39.12,31.79 | 39.12,31.79 12.15,31.79 v11.3,32.64 | U4.VCC_2V8 53.54,32.82 v52.83,33.53 | v39.12,33.27 39.12,31.79
  Bottom 0.203: v11.3,32.64 v13.46,34.8
  Bottom 0.406: v52.83,33.53 39.37,33.53 v39.12,33.27
VCCSIM
  Top 0.203: 23.84,4.19 U10.3 23.81,3.24 23.75,3.17 17.27,3.17 U9.2 17.27,1.52 20.45,1.52 21.34,2.16 50.99,2.16 51.01,2.44 53.59,7.37 53.59,16.52 U4.SIM_VCC | 25.02,4.19 25.15,4.32 | C6.1 25.24,5.08 25.78,5.08 25.91,5.21 25.91,8.51 24.68,9.74 U8.VCC
  Top 0.406: 23.84,4.19 25.02,4.19 | 25.15,4.32 C6.1
VDD  (via drill 0.5)
  Top 0.203: R5.2 88.63,24.55 L1.P2 | R3.2 81.53,18.2 81.53,21.72 U4.VBAT1 U4.VBAT2 75.95,23.75 77.85,23.75 77.72,23.88 77.72,33.27 74.55,36.45 v38.48,36.45 38.48,35.31 35.18,35.31 35.18,34.8 35.05,34.67 30.99,34.67 30.1,33.78 11.05,33.78 10.16,34.67 | 10.16,34.67 TP3.TP | LED3.A 8.38,32.89 10.16,34.67
  Top 0.406: C2.1 C3.1 | C3.1 84.07,18.9 L1.P2 88.77,24 88.52,24.26 88.52,17.83 U2.PAD11 | R3.2 83.78,18 C3.1
  pour Top (no thermals): 77.72,21.21 79.25,19.68 80.01,19.68 81.03,18.67 81.03,17.65 86.74,17.65 86.74,19.3 87.25,19.81 88.14,19.81 88.9,20.95 90.17,20.95 90.17,25.02 78.23,25.02 76.96,23.75 74.42,23.75 74.42,21.21

### Text on the board
tPlace: 3.5V | GSM | VIN | 1.8V | WellDone Flowmeter / Prototype v2 / 12/2/12